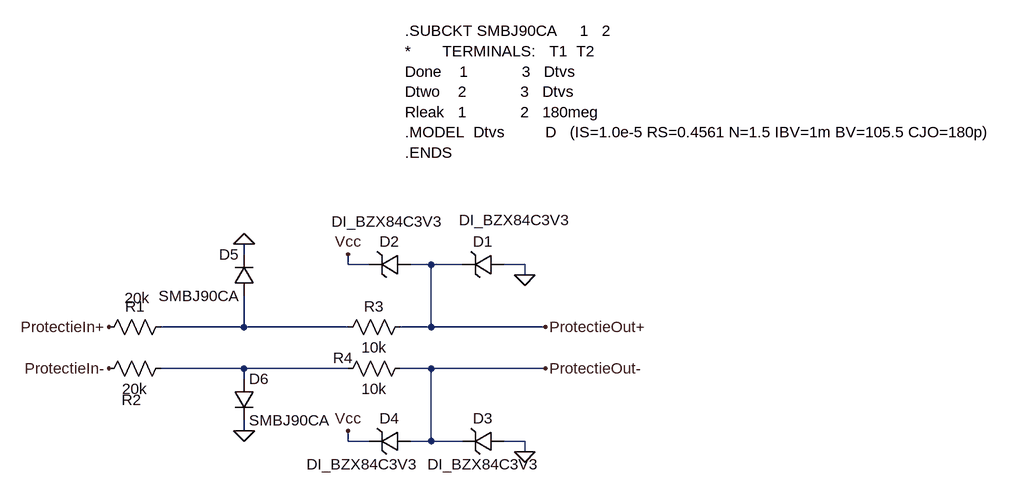
[diagram p0: schematic Draft4.asc]
Draft4.asc, the LTspice schematic file:
Version 4.1
SHEET 1 1180 680
WIRE 64 0 64 -16
WIRE 224 16 224 0
WIRE 256 16 224 16
WIRE 352 16 320 16
WIRE 400 16 352 16
WIRE 496 16 464 16
WIRE 496 32 496 16
WIRE 64 112 64 64
WIRE 64 112 -64 112
WIRE 224 112 64 112
WIRE 352 112 352 16
WIRE 352 112 304 112
WIRE 528 112 352 112
WIRE 64 176 -64 176
WIRE 224 176 64 176
WIRE 352 176 304 176
WIRE 528 176 352 176
WIRE 64 192 64 176
WIRE 64 272 64 256
WIRE 224 288 224 272
WIRE 256 288 224 288
WIRE 352 288 352 176
WIRE 352 288 320 288
WIRE 400 288 352 288
WIRE 496 288 464 288
WIRE 496 304 496 288
FLAG 496 32 0
FLAG 224 0 Vcc
FLAG 496 304 0
FLAG 224 272 Vcc
FLAG 64 -16 0
FLAG 64 272 0
FLAG 528 112 ProtectieOut+
FLAG 528 176 ProtectieOut-
FLAG -144 112 ProtectieIn+
FLAG -144 176 ProtectieIn-
SYMBOL res -48 96 R90
WINDOW 0 0 56 VBottom 2
WINDOW 3 -44 52 VTop 2
SYMATTR InstName R1
SYMATTR Value 20k
SYMBOL res -48 160 R90
WINDOW 0 80 61 VBottom 2
WINDOW 3 32 56 VTop 2
SYMATTR InstName R2
SYMATTR Value 20k
SYMBOL res 320 96 R90
WINDOW 0 0 56 VBottom 2
WINDOW 3 32 56 VTop 2
SYMATTR InstName R3
SYMATTR Value 10k
SYMBOL res 320 160 R90
WINDOW 0 15 104 VBottom 2
WINDOW 3 32 56 VTop 2
SYMATTR InstName R4
SYMATTR Value 10k
SYMBOL zener 464 0 R90
WINDOW 0 -4 32 VBottom 2
WINDOW 3 -68 -16 VTop 2
SYMATTR InstName D1
SYMATTR Value DI_BZX84C3V3
SYMATTR Prefix X
SYMBOL zener 320 0 R90
WINDOW 0 -4 32 VBottom 2
WINDOW 3 -66 36 VTop 2
SYMATTR InstName D2
SYMATTR Value DI_BZX84C3V3
SYMATTR Prefix X
SYMBOL zener 464 272 R90
WINDOW 0 -4 32 VBottom 2
WINDOW 3 36 32 VTop 2
SYMATTR InstName D3
SYMATTR Value DI_BZX84C3V3
SYMATTR Prefix X
SYMBOL zener 320 272 R90
WINDOW 0 -4 32 VBottom 2
WINDOW 3 36 74 VTop 2
SYMATTR InstName D4
SYMATTR Value DI_BZX84C3V3
SYMATTR Prefix X
SYMBOL diode 80 64 R180
WINDOW 0 24 64 Left 2
WINDOW 3 24 0 Left 2
SYMATTR InstName D5
SYMATTR Value SMBJ90CA
SYMATTR Prefix X
SYMBOL diode 48 192 R0
SYMATTR InstName D6
SYMATTR Value SMBJ90CA
SYMATTR Prefix X
TEXT 312 -344 Left 2 !.SUBCKT SMBJ90CA     1   2\n*       TERMINALS:   T1  T2\nDone    1            3   Dtvs\nDtwo    2            3   Dtvs\nRleak   1            2   180meg\n.MODEL  Dtvs         D   (IS=1.0e-5 RS=0.4561 N=1.5 IBV=1m BV=105.5 CJO=180p)\n.ENDS

The netlist it stands for:
* Draft4.asc
R1 N001 ProtectieIn+ 20k
R2 N002 ProtectieIn- 20k
R3 ProtectieOut+ N001 10k
R4 ProtectieOut- N002 10k
X§D1 0 ProtectieOut+ DI_BZX84C3V3  ; pins + -
X§D2 ProtectieOut+ Vcc DI_BZX84C3V3  ; pins + -
X§D3 0 ProtectieOut- DI_BZX84C3V3  ; pins + -
X§D4 ProtectieOut- Vcc DI_BZX84C3V3  ; pins + -
X§D5 N001 0 SMBJ90CA  ; pins + -
X§D6 N002 0 SMBJ90CA  ; pins + -
.SUBCKT SMBJ90CA     1   2
*       TERMINALS:   T1  T2
Done    1            3   Dtvs
Dtwo    2            3   Dtvs
Rleak   1            2   180meg
.MODEL  Dtvs         D   (IS=1.0e-5 RS=0.4561 N=1.5 IBV=1m BV=105.5 CJO=180p)
.ENDS
.backanno
.end